# Altium schematic sheet Camera.SchDoc
size A
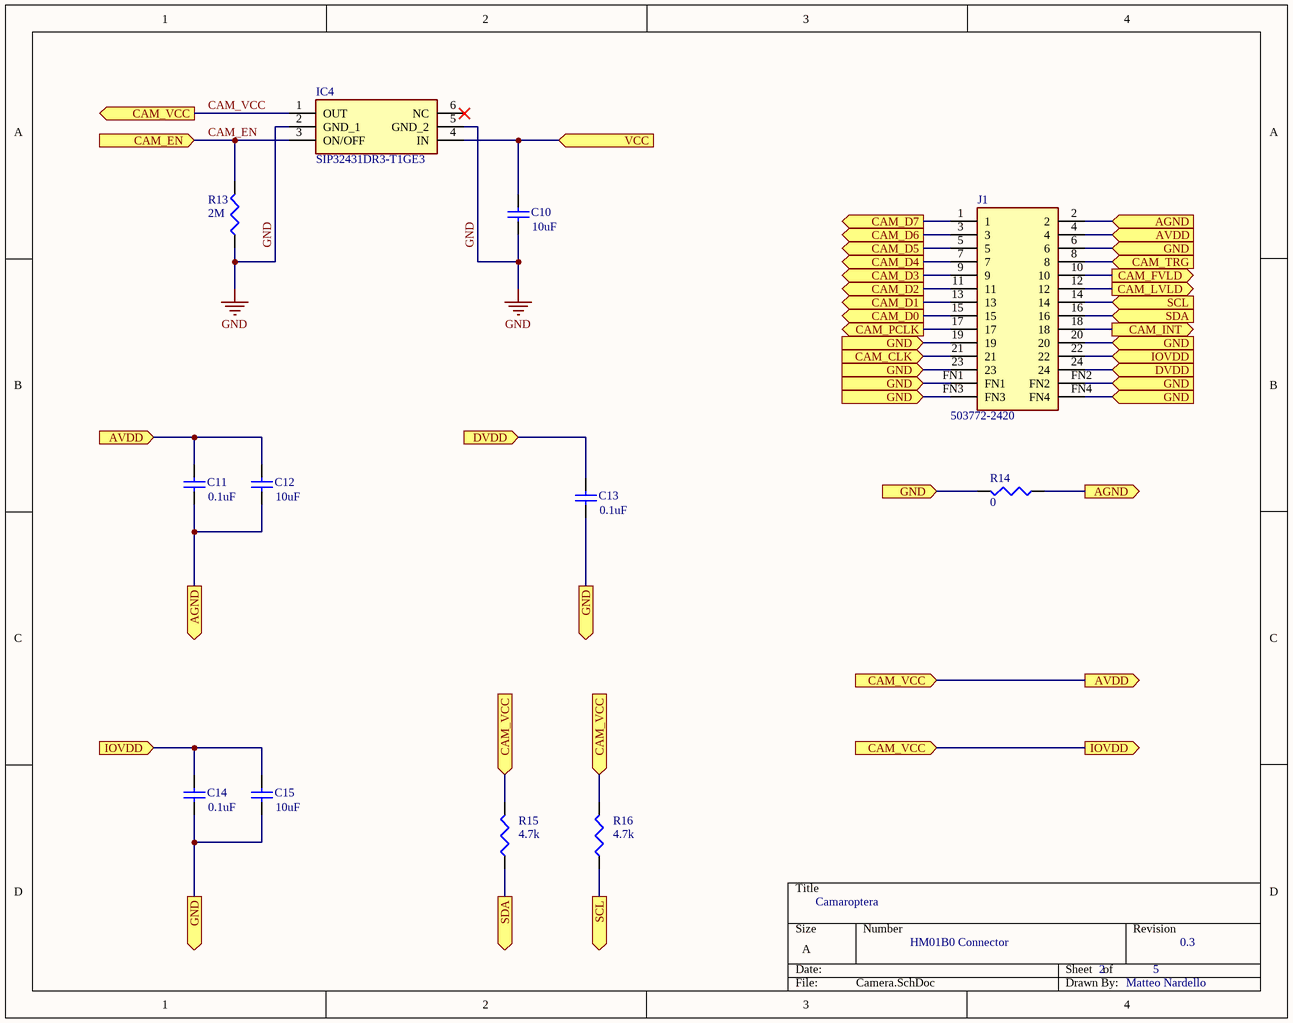
[diagram p0: Camera.SchDoc]

## Parts
C10  value 10uF  [1608[0603]]  (hidden comment: Cap)
C11  value 0.1uF  [1608[0603]]  (hidden comment: Cap)
C12  value 10uF  [1608[0603]]  (hidden comment: Cap)
C13  value 0.1uF  [1608[0603]]  (hidden comment: Cap)
C14  value 0.1uF  [1608[0603]]  (hidden comment: Cap)
C15  value 10uF  [1608[0603]]  (hidden comment: Cap)
IC4  SIP32431DR3-T1GE3  [SOT65P210X110-6N]
J1  503772-2420  [5037722410]
R13  value 2M  [J1-0603]  (hidden comment: Res3)
R14  value 0  [J1-0603]  (hidden comment: Res3)
R15  value 4.7k  [J1-0603]  (hidden comment: Res3)
R16  value 4.7k  [J1-0603]  (hidden comment: Res3)

## Ports
AGND (in), AGND (out), AVDD (in), AVDD (out), CAM_CLK (in), CAM_D0 (out), CAM_D1 (out), CAM_D2 (out), CAM_D3 (out), CAM_D4 (out), CAM_D5 (out), CAM_D6 (out), CAM_D7 (out), CAM_EN (in), CAM_FVLD (out), CAM_INT (out), CAM_LVLD (out), CAM_PCLK (out), CAM_TRG (in), CAM_VCC (in), CAM_VCC (out), DVDD (in), GND (in), GND (out), IOVDD (in), IOVDD (out), SCL (in), SCL (out), SDA (in), SDA (out), VCC (in)

## Nets
GND: C10.1 IC4.2(GND_1) IC4.5(GND_2) R13.1
AGND: C11.1 C12.1 J1.2 R14.1 ; port AGND
CAM_CLK: J1.21 ; port CAM_CLK
CAM_D0: J1.15 ; port CAM_D0
CAM_D1: J1.13 ; port CAM_D1
CAM_D2: J1.11 ; port CAM_D2
CAM_D3: J1.9 ; port CAM_D3
CAM_D4: J1.7 ; port CAM_D4
CAM_D5: J1.5 ; port CAM_D5
CAM_D6: J1.3 ; port CAM_D6
CAM_D7: J1.1 ; port CAM_D7
CAM_EN: IC4.3(ON/OFF) R13.2 ; port CAM_EN
CAM_FVLD: J1.10 ; port CAM_FVLD
CAM_INT: J1.18 ; port CAM_INT
CAM_LVLD: J1.12 ; port CAM_LVLD
CAM_PCLK: J1.17 ; port CAM_PCLK
CAM_TRG: J1.8 ; port CAM_TRG
CAM_VCC: C11.2 C12.2 C14.2 C15.2 IC4.1(OUT) J1.4 J1.22 R15.2 R16.2 ; port CAM_VCC, port AVDD, port IOVDD
DVDD: C13.2 J1.24 ; port DVDD
GND: C13.1 C14.1 C15.1 J1.6 J1.19 J1.20 J1.23 J1.FN1 J1.FN2 J1.FN3 J1.FN4 R14.2 ; port GND  [a separate net that carries the same name]
SCL: J1.14 R16.1 ; port SCL
SDA: J1.16 R15.1 ; port SDA
VCC: C10.2 IC4.4(IN) ; port VCC

Not connected (* = marked no-connect by the designer): IC4 6(NC)*

## Notes on the sheet
- Camaroptera
- HM01B0 Connector
- 2
- 5
- 0.3
- Matteo Nardello

## Library data of the parts
C10-C15 = Cap: CAP CER 6.3V X5R/X7R 0603; PackageReference: 0603; Publisher: Altium Limited; PackageDescription: Chip Capacitor, Body 1.6x0.8mm, IPC High Density
IC4 = SIP32431DR3-T1GE3: 10 pA, Ultra Low Leakage and Quiescent Current, / Load Switch with Reverse Blocking; Manufacturer_Name: Vishay; Datasheet Link: https://componentsearchengine.com/Datasheets/1/SIP32431DR3-T1GE3.pdf; Height: 1.1mm; Mouser Part Number: 781-SIP32431DR3-GE3; Mouser Price/Stock: https://www.mouser.com/Search/Refine.aspx?Keyword=781-SIP32431DR3-GE3; Manufacturer_Part_Number: SIP32431DR3-T1GE3; ComponentLink1Description: Datasheet; ComponentLink1URL: https://www.vishay.com/docs/66597/sip32431.pdf; ComponentLink2Description: Package Specification; ComponentLink2URL: https://www.vishay.com/docs/71154/71154.pdf; ComponentLink3Description: Manufacturer URL; ComponentLink3URL: https://www.vishay.com
J1 = 503772-2410: SlimStack Board-to-Board Connector. 0.40mm Pitch, B8 Series, Receptacle, 0.80mm Mated Height, 2.50mm Mated Width, 24 Circuits; Manufacturer_Name: Molex; Datasheet Link: https://componentsearchengine.com/Datasheets/1/503772-2410.pdf; Height: 0.76mm; Mouser Part Number: 538-503772-2410; Mouser Price/Stock: https://www.mouser.com/Search/Refine.aspx?Keyword=538-503772-2410; Manufacturer_Part_Number: 503772-2410; ComponentLink1Description: Package Specification; ComponentLink1URL: https://www.molex.com/pdm_docs/sd/5037722420_sd.pdf; ComponentLink2Description: Manufacturer URL; ComponentLink2URL: https://www.molex.com; ComponentLink3Description: Datasheet; ComponentLink3URL: https://www.molex.com/webdocs/datasheets/pdf/en-us/5037722420_PCB_RECEPTACLES.pdf
R13-R16 = Res3: RES 1/10W 1% 0603 SMD; PackageReference: 0603; Publisher: Altium Limited; PackageDescription: Chip Resistor, Body 1.6x0.8mm, IPC High Density